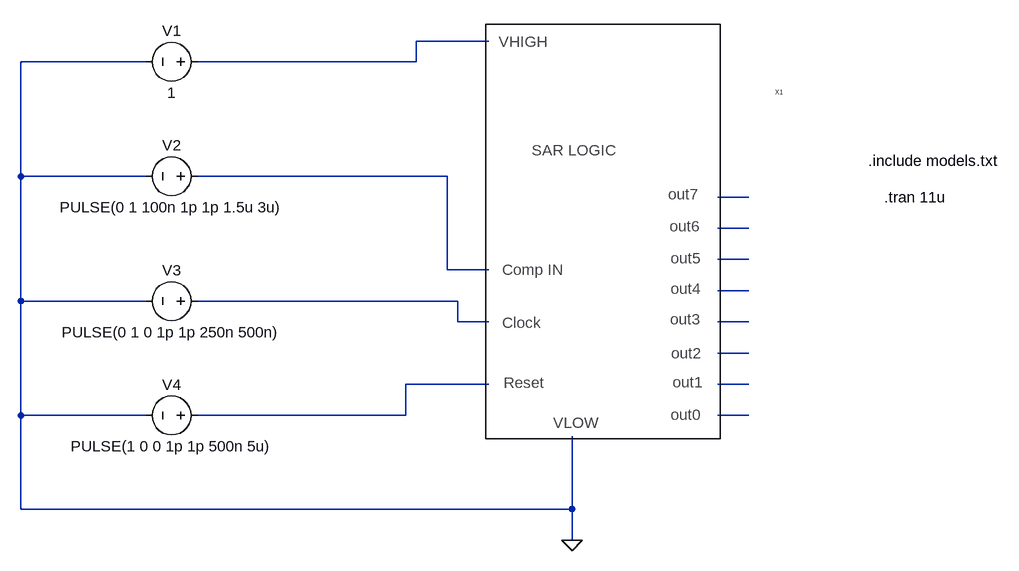
[diagram p0: schematic SAR_test.asc]
SAR_test.asc, the LTspice schematic file:
Version 4
SHEET 1 880 680
WIRE -32 -160 -144 -160
WIRE -560 -128 -752 -128
WIRE -144 -128 -144 -160
WIRE -144 -128 -480 -128
WIRE -752 48 -752 -128
WIRE -560 48 -752 48
WIRE -96 48 -480 48
WIRE 368 80 320 80
WIRE 368 128 320 128
WIRE 368 176 320 176
WIRE -96 192 -96 48
WIRE -32 192 -96 192
WIRE 368 224 320 224
WIRE -752 240 -752 48
WIRE -560 240 -752 240
WIRE -80 240 -480 240
WIRE -80 272 -80 240
WIRE -32 272 -80 272
WIRE 368 272 320 272
WIRE 368 320 320 320
WIRE -32 368 -160 368
WIRE 368 368 320 368
WIRE -752 416 -752 240
WIRE -560 416 -752 416
WIRE -160 416 -160 368
WIRE -160 416 -480 416
WIRE 368 416 320 416
WIRE -752 560 -752 416
WIRE 96 560 96 448
WIRE 96 560 -752 560
WIRE 96 608 96 560
FLAG 96 608 0
SYMBOL SAR_logic 96 -32 R0
SYMATTR InstName X1
SYMBOL voltage -464 -128 R90
WINDOW 0 -32 56 VBottom 2
WINDOW 3 32 56 VTop 2
WINDOW 123 0 0 Left 0
WINDOW 39 0 0 Left 0
SYMATTR InstName V1
SYMATTR Value 1
SYMBOL voltage -464 48 R90
WINDOW 0 -32 56 VBottom 2
WINDOW 3 32 56 VTop 2
WINDOW 123 0 0 Left 0
WINDOW 39 0 0 Left 0
SYMATTR InstName V2
SYMATTR Value PULSE(0 1 100n 1p 1p 1.5u 3u)
SYMBOL voltage -464 240 R90
WINDOW 0 -32 56 VBottom 2
WINDOW 3 32 56 VTop 2
WINDOW 123 0 0 Left 0
WINDOW 39 0 0 Left 0
SYMATTR InstName V3
SYMATTR Value PULSE(0 1 0 1p 1p 250n 500n)
SYMBOL voltage -464 416 R90
WINDOW 0 -32 56 VBottom 2
WINDOW 3 32 56 VTop 2
WINDOW 123 0 0 Left 0
WINDOW 39 0 0 Left 0
SYMATTR InstName V4
SYMATTR Value PULSE(1 0 0 1p 1p 500n 5u)
TEXT 552 24 Left 2 !.include models.txt
TEXT 576 80 Left 2 !.tran 11u

The netlist it stands for:
* SAR_test.asc
XX1 N012 N011 N009 N008 N006 N005 N004 N003 N010 0 N007 N002 N001 SAR_logic  ; pins out0 out1 out2 out3 out4 out5 out6 out7 Reset VLOW Clk Comp VHIGH
V1 N001 0 1
V2 N002 0 PULSE(0 1 100n 1p 1p 1.5u 3u)
V3 N007 0 PULSE(0 1 0 1p 1p 250n 500n)
V4 N010 0 PULSE(1 0 0 1p 1p 500n 5u)
.include models.txt
.tran 11u
.backanno
.end